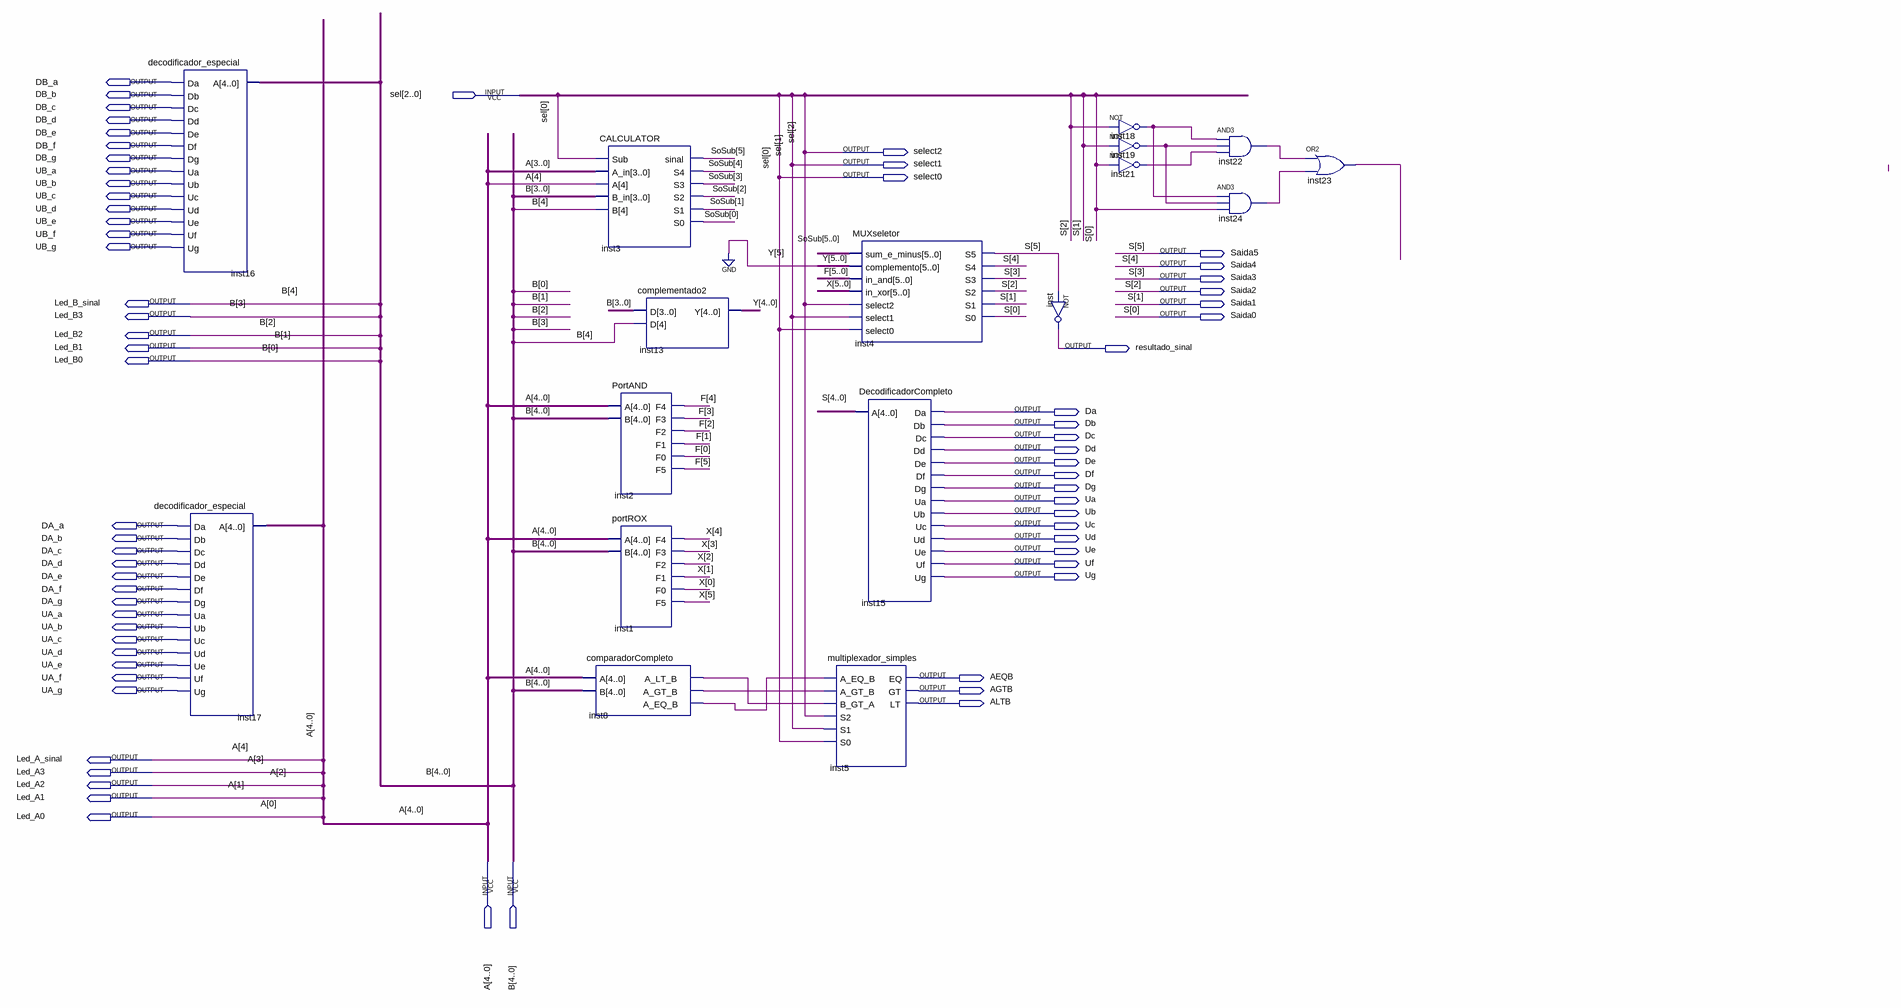
[diagram p0: schematic sheet]
// Quartus schematic ProjetoSD.bdf as structural Verilog: 17 symbols, 68 pins
module ProjetoSD (
  input  [2:0] sel,
  input  [4:0] A,
  input  [4:0] B,
  output DB_a,
  output DB_b,
  output DB_c,
  output DB_d,
  output DB_e,
  output DB_f,
  output select2,
  output DB_g,
  output select1,
  output UB_a,
  output select0,
  output UB_b,
  output UB_c,
  output UB_d,
  output UB_e,
  output UB_f,
  output UB_g,
  output Saida5,
  output Saida4,
  output Saida3,
  output Saida2,
  output Led_B_sinal,
  output Saida1,
  output Led_B3,
  output Saida0,
  output Led_B2,
  output Led_B1,
  output resultado_sinal,
  output Led_B0,
  output Da,
  output Db,
  output Dc,
  output Dd,
  output De,
  output Df,
  output Dg,
  output Ua,
  output Ub,
  output DA_a,
  output Uc,
  output DA_b,
  output Ud,
  output DA_c,
  output Ue,
  output DA_d,
  output Uf,
  output DA_e,
  output Ug,
  output DA_f,
  output DA_g,
  output UA_a,
  output UA_b,
  output UA_c,
  output UA_d,
  output UA_e,
  output UA_f,
  output AEQB,
  output UA_g,
  output AGTB,
  output ALTB,
  output Led_A_sinal,
  output Led_A3,
  output Led_A2,
  output Led_A1,
  output Led_A0
);

  wire inst8_a_eq_b, inst8_a_gt_b, inst8_a_lt_b, inst18_out, inst19_out, inst21_out, inst22_out, inst23_out,
       inst24_out;
  wire [4:0] Y;
  wire [5:0] F, SoSub, X;

  decodificador_especial inst16 (
    .A(B), .Da(DB_a), .Db(DB_b), .Dc(DB_c), .Dd(DB_d), .De(DB_e), .Df(DB_f), .Dg(DB_g), .Ua(UB_a), .Ub(UB_b),
    .Uc(UB_c), .Ud(UB_d), .Ue(UB_e), .Uf(UB_f), .Ug(UB_g));
  decodificador_especial inst17 (
    .A(A), .Da(DA_a), .Db(DA_b), .Dc(DA_c), .Dd(DA_d), .De(DA_e), .Df(DA_f), .Dg(DA_g), .Ua(UA_a), .Ub(UA_b),
    .Uc(UA_c), .Ud(UA_d), .Ue(UA_e), .Uf(UA_f), .Ug(UA_g));
  CALCULATOR inst3 (
    .Sub(sel[0]), .A_in(A[3:0]), .A(A[4]), .B_in(B[3:0]), .B(B[4]), .sinal(SoSub[5]), .S4(SoSub[4]),
    .S3(SoSub[3]), .S2(SoSub[2]), .S1(SoSub[1]), .S0(SoSub[0]));
  comparadorCompleto inst8 (.A(A), .B(B), .A_LT_B(inst8_a_lt_b), .A_GT_B(inst8_a_gt_b), .A_EQ_B(inst8_a_eq_b));
  complementado2 inst13 (.D(B), .Y(Y));
  PortAND inst2 (.A(A), .B(B), .F4(F[4]), .F3(F[3]), .F2(F[2]), .F1(F[1]), .F0(F[0]), .F5(F[5]));
  portROX inst1 (.A(A), .B(B), .F4(X[4]), .F3(X[3]), .F2(X[2]), .F1(X[1]), .F0(X[0]), .F5(X[5]));
  MUXseletor inst4 (
    .sum_e_minus(SoSub), .complemento({1'b0, Y}), .in_and(F), .in_xor(X), .select2(sel[2]), .select1(sel[1]),
    .select0(sel[0]), .S5(Saida5), .S4(Saida4), .S3(Saida3), .S2(Saida2), .S1(Saida1), .S0(Saida0));
  DecodificadorCompleto inst15 (
    .A({Saida4, Saida3, Saida2, Saida1, Saida0}), .Da(Da), .Db(Db), .Dc(Dc), .Dd(Dd), .De(De), .Df(Df),
    .Dg(Dg), .Ua(Ua), .Ub(Ub), .Uc(Uc), .Ud(Ud), .Ue(Ue), .Uf(Uf), .Ug(Ug));
  multiplexador_simples inst5 (
    .A_EQ_B(inst8_a_eq_b), .A_GT_B(inst8_a_gt_b), .B_GT_A(inst8_a_lt_b), .S2(sel[2]), .S1(sel[1]),
    .S0(sel[0]), .EQ(AEQB), .GT(AGTB), .LT(ALTB));
  not inst (resultado_sinal, Saida5);
  not inst18 (inst18_out, Saida2);
  not inst19 (inst19_out, Saida1);
  not inst21 (inst21_out, Saida0);
  and inst22 (inst22_out, inst18_out, inst19_out, inst21_out);
  and inst24 (inst24_out, inst18_out, inst19_out, Saida0);
  or inst23 (inst23_out, inst22_out, inst24_out);

  assign Led_A0 = A[0];
  assign Led_A1 = A[1];
  assign Led_A2 = A[2];
  assign Led_A3 = A[3];
  assign Led_A_sinal = A[4];
  assign Led_B0 = B[0];
  assign Led_B1 = B[1];
  assign Led_B2 = B[2];
  assign Led_B3 = B[3];
  assign Led_B_sinal = B[4];
  assign select0 = sel[0];
  assign select1 = sel[1];
  assign select2 = sel[2];

  // Other names for the same wires on the sheet: S[5:0] = {Saida5, Saida4, Saida3, Saida2, Saida1, Saida0}
endmodule
